# Altium schematic sheet 32minboard.SchDoc
size A3
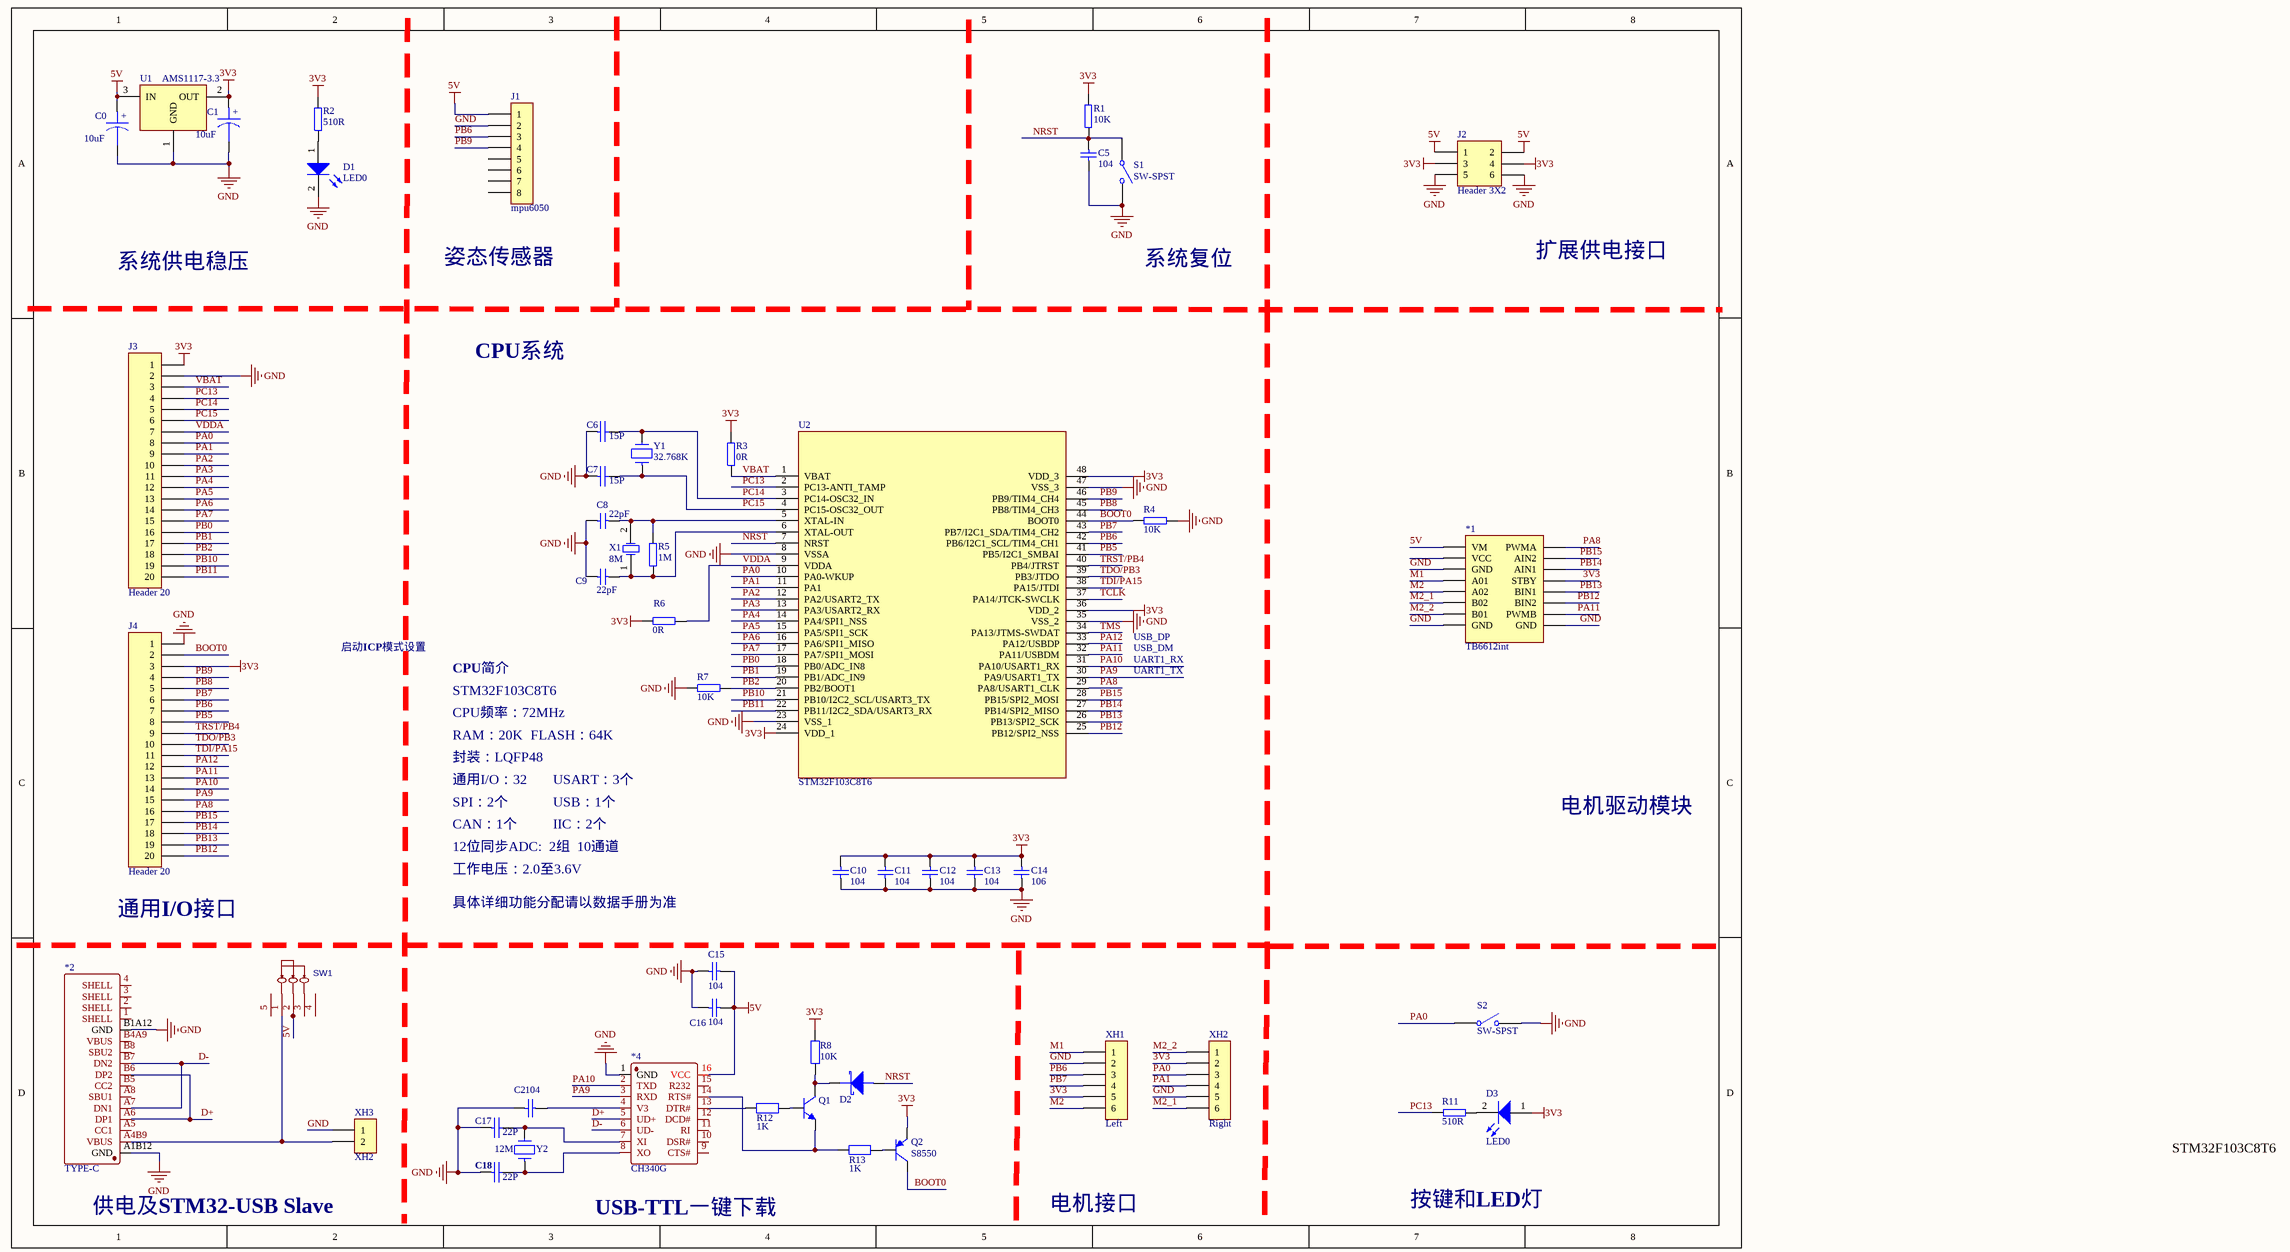
[diagram p0: 32minboard.SchDoc]

## Parts
*1  TB6612int  [TB6612int]
*2  TYPE-C  [TYPE-C]
*4  CH340G  [SOIC-16_L9.9-W3.9-P1.27-LS6.0-BR]
C0  10uF  [CAP-TANTALUM-A]
C1  10uF  [CAP-TANTALUM-A]
C2  104  [0603]
C5  104  [0603]
C6  15P  [0603]
C7  15P  [0603]
C8  22pF  [0603]
C9  22pF  [0603]
C10  104  [0603]
C11  104  [0603]
C12  104  [0603]
C13  104  [0603]
C14  106  [0603]
C15  104  [0603]
C16  104  [0603]
C17  22P  [0603]
C18  22P  [0603]
D1  LED0  [LED-0805]
D2  DIODE SCHOTTKY  [LL34]  (value not drawn)
D3  LED0  [LED-0805]
J1  mpu6050  [PIN-8-2.54-1.0]
J2  Header 3X2  [PIN-2x3-2.54-1.0]
J3  Header 20  [PIN-20-2.54-1.0]
J4  Header 20  [PIN-20-2.54-1.0]
Q1  MMBT2222A  [SOT-23]  (value not drawn)
Q2  S8550  [SOT-23]
R1  10K  [0603]
R2  510R  [0603]
R3  0R  [0603]
R4  10K  [0603]
R5  1M  [0603]
R6  0R  [0603]
R7  10K  [0603]
R8  10K  [0603]
R11  510R  [0603]
R12  1K  [0603]
R13  1K  [0603]
S1  SW-SPST  [KEY-SWD-3X4X2]
S2  SW-SPST  [KEY-SWD-3X4X2]
SW1  SK12D07VG5  [SW-TH_SK12D07VG5]  (value not drawn)
U1  AMS1117-3.3  [SOT223]
U2  STM32F103C8T6  [QFP-48-0.5]
X1  8M  [OSC HC-49SMD]
XH1  Left  [XH6/2.54mm/180]
XH2  Right  [XH6/2.54mm/180]
XH3  XH2  [XH2/2.54mm/180]
Y1  32.768K  [OSC-3x8-WI-B]
Y2  12M  [OSC HC-49SMD]

## Nets
3V3: *1.13(STBY) C1.1 C10.1 C11.1 C12.1 C13.1 C14.1 D3.1(A) J2.3 J2.4 J3.1 J4.3 Q2.3(E) R1.2 R2.2 R3.2 R6.2 R8.1 U1.2(OUT) U2.24(VDD_1) U2.36(VDD_2) U2.48(VDD_3) XH1.5 XH2.2
5V: *1.1(VM) *4.16(VCC) C0.1 C15.1 C16.1 J1.1 J2.1 J2.2 SW1.2 U1.3(IN)
GND: *1.3(GND) *1.8(GND) *1.9(GND) *2.A1B12(GND) *2.B1A12(GND) *4.1(GND) C0.2 C1.2 C2.2 C5.2 C6.1 C7.1 C8.2 C9.2 C10.2 C11.2 C12.2 C13.2 C14.2 C15.2 C16.2 C17.1 C18.1 D1.2(K) J1.2 J2.5 J2.6 J3.2 J4.1 R4.1 R7.2 S1.2(NO) S2.2(NO) U1.1(GND) U2.8(VSSA) U2.23(VSS_1) U2.35(VSS_2) U2.47(VSS_3) XH1.2 XH2.5 XH3.1
BOOT0: J4.2 Q2.2(C) R4.2 U2.44(BOOT0)
D+: *2.A6(DP1) *2.B6(DP2) *4.5(UD+)
D-: *2.A7(DN1) *2.B7(DN2) *4.6(UD-)
M1: *1.4(A01) XH1.1
M2: *1.5(A02) XH1.6
M2_1: *1.6(B02) XH2.6
M2_2: *1.7(B01) XH2.1
NRST: C5.1 D2.A R1.1 S1.1(COMMON) U2.7(NRST)
PA0: J3.8 S2.1(COMMON) U2.10(PA0-WKUP) XH2.3
PA1: J3.9 U2.11(PA1) XH2.4
PA2: J3.10 U2.12(PA2/USART2_TX)
PA3: J3.11 U2.13(PA3/USART2_RX)
PA4: J3.12 U2.14(PA4/SPI1_NSS)
PA5: J3.13 U2.15(PA5/SPI1_SCK)
PA6: J3.14 U2.16(PA6/SPI1_MISO)
PA7: J3.15 U2.17(PA7/SPI1_MOSI)
PA8: *1.16(PWMA) J4.16 U2.29(PA8/USART1_CLK)
PA9: *4.3(RXD) J4.15 U2.30(PA9/USART1_TX)
PA10: *4.2(TXD) J4.14 U2.31(PA10/USART1_RX)
PA11: *1.10(PWMB) J4.13 U2.32(PA11/USBDM)
PA12: J4.12 U2.33(PA12/USBDP)
PB0: J3.16 U2.18(PB0/ADC_IN8)
PB1: J3.17 U2.19(PB1/ADC_IN9)
PB2: J3.18 R7.1 U2.20(PB2/BOOT1)
PB5: J4.8 U2.41(PB5/I2C1_SMBAI)
PB6: J1.3 J4.7 U2.42(PB6/I2C1_SCL/TIM4_CH1) XH1.3
PB7: J4.6 U2.43(PB7/I2C1_SDA/TIM4_CH2) XH1.4
PB8: J4.5 U2.45(PB8/TIM4_CH3)
PB9: J1.4 J4.4 U2.46(PB9/TIM4_CH4)
PB10: J3.19 U2.21(PB10/I2C2_SCL/USART3_TX)
PB11: J3.20 U2.22(PB11/I2C2_SDA/USART3_RX)
PB12: *1.11(BIN2) J4.20 U2.25(PB12/SPI2_NSS)
PB13: *1.12(BIN1) J4.19 U2.26(PB13/SPI2_SCK)
PB14: *1.14(AIN1) J4.18 U2.27(PB14/SPI2_MISO)
PB15: *1.15(AIN2) J4.17 U2.28(PB15/SPI2_MOSI)
PC13: J3.4 R11.1 U2.2(PC13-ANTI_TAMP)
PC14: C6.2 J3.5 U2.3(PC14-OSC32_IN) Y1.2
PC15: C7.2 J3.6 U2.4(PC15-OSC32_OUT) Y1.1
TCLK: U2.37(PA14/JTCK-SWCLK)
TDI/PA15: J4.11 U2.38(PA15/JTDI)
TDO/PB3: J4.10 U2.39(PB3/JTDO)
TMS: U2.34(PA13/JTMS-SWDAT)
TRST/PB4: J4.9 U2.40(PB4/JTRST)
VBAT: J3.3 R3.1 U2.1(VBAT)
VDDA: J3.7 R6.1 U2.9(VDDA)
Net*2_A4B9: *2.A4B9(VBUS) SW1.1 XH3.2
Net*4_4: *4.4(V3) C2.1
Net*4_7: *4.7(XI) C17.2 Y2.2
Net*4_8: *4.8(XO) C18.2 Y2.1
Net*4_13: *4.13(DTR#) R12.2
Net*4_14: *4.14(RTS#) Q1.2(E) R13.2
NetC8_1: C8.1 R5.2 U2.5(XTAL-IN) X1.2
NetC9_1: C9.1 R5.1 U2.6(XTAL-OUT) X1.1
NetD1_1: D1.1(A) R2.1
NetD2_K: D2.K Q1.3(C) R8.2
NetD3_2: D3.2(K) R11.2
NetQ1_1: Q1.1(B) R12.1
NetQ2_1: Q2.1(B) R13.1

Not connected (* = marked no-connect by the designer): *1 2(VCC); *2 1(SHELL) 2(SHELL) 3(SHELL) 4(SHELL) A5(CC1) A8(SBU1) B4A9(VBUS) B5(CC2) B8(SBU2); *4 9(CTS#) 10(DSR#) 11(RI) 12(DCD#) 15(R232); J1 5 6 7 8; SW1 3 4 5

## Notes on the sheet
- 姿态传感器
- 扩展供电接口
- 系统供电稳压
- 系统复位
- CPU系统
- 启动ICP模式设置
- USB_DM
- USB_DP
- STM32F103C8T6
- CPU简介
- UART1_TX
- UART1_RX
- RAM：20K
- 封装：LQFP48
- CPU频率：72MHz
- FLASH：64K
- 通用I/O：32
- SPI：2个
- USART：3个
- USB：1个
- 电机驱动模块
- CAN：1个
- 12位同步ADC:  2组  10通道
- 工作电压：2.0至3.6V
- IIC：2个
- 通用I/O接口
- 具体详细功能分配请以数据手册为准
- 电机接口
- 按键和LED灯
- (near *2) 供电及STM32-USB Slave
- (near *4) USB-TTL一键下载
- (in symbol CAPACITOR POL) +

## Library data of the parts
C0 C1 = CAPACITOR POL: Capacitor
C2 C15 C16 = Cap: Capacitor
C5 C10-C14 = CAP1: Capacitor; Tolerate: 50V; Value: 100nF; TOL: 10%; ERP: 0103020075; PCB_Layout: Top Layer SMC; Revision: 2012-3-28; Publisher: ZL_A0OFFICE
C6 C7 C17 C18 = CAP
C8 C9 = CAP1: Capacitor; Tolerate: 50V; Value: 20pF; TOL: 2%; ERP: 0103020090; PCB_Layout: Top Layer SMC; Revision: 2012-3-28; Publisher: ZL_A0OFFICE
D1 D3 = LED0: Typical INFRARED GaAs LED
D2 = DIODE SCHOTTKY: 肖特基二极管
J1 = HDR1x8: Connector
J2 = Header 3X2: Header, 3-Pin, Dual row; LatestRevisionDate: 17-Jul-2002; LatestRevisionNote: Re-released for DXP Platform.; Publisher: Altium Limited
J3 J4 = Header 20: Header, 20-Pin; LatestRevisionDate: 17-Jul-2002; LatestRevisionNote: Re-released for DXP Platform.; Publisher: Altium Limited
Q1 = MMBT2222A: NPN Bipolar Transistor
Q2 = PNP: NPN Bipolar Transistor
R1-R7 R11 = R
R8 R12 R13 = Res2: Resistor
S1 S2 = SW-SPST: Single-Pole, Single-Throw Switch
SW1 = SK12D07VG5: BOM_Manufacturer: SHOU HAN; Contributor: LCSC; BOM_Supplier: LCSC; BOM_Supplier Part: C431548; BOM_Manufacturer Part: SK12D07VG5; spicePre: S; spiceSymbolName: SK12D07VG5
U1 = LT1085CM-3.3
X1 = XTAL_SMD: Crystal Oscillator; ERP: 0103040021; Value: 8MHz; TOL: ±20ppm; Tolerate: ROSON -20_+70 20pf; PCB_Layout: Top Layer SMC; Publisher: ZL_A0OFFICE; Revision: 2012-3-28
XH1 XH2 = XH6
Y1 Y2 = CRYSTAL: 晶振